# Altium project project_1.PrjPcb
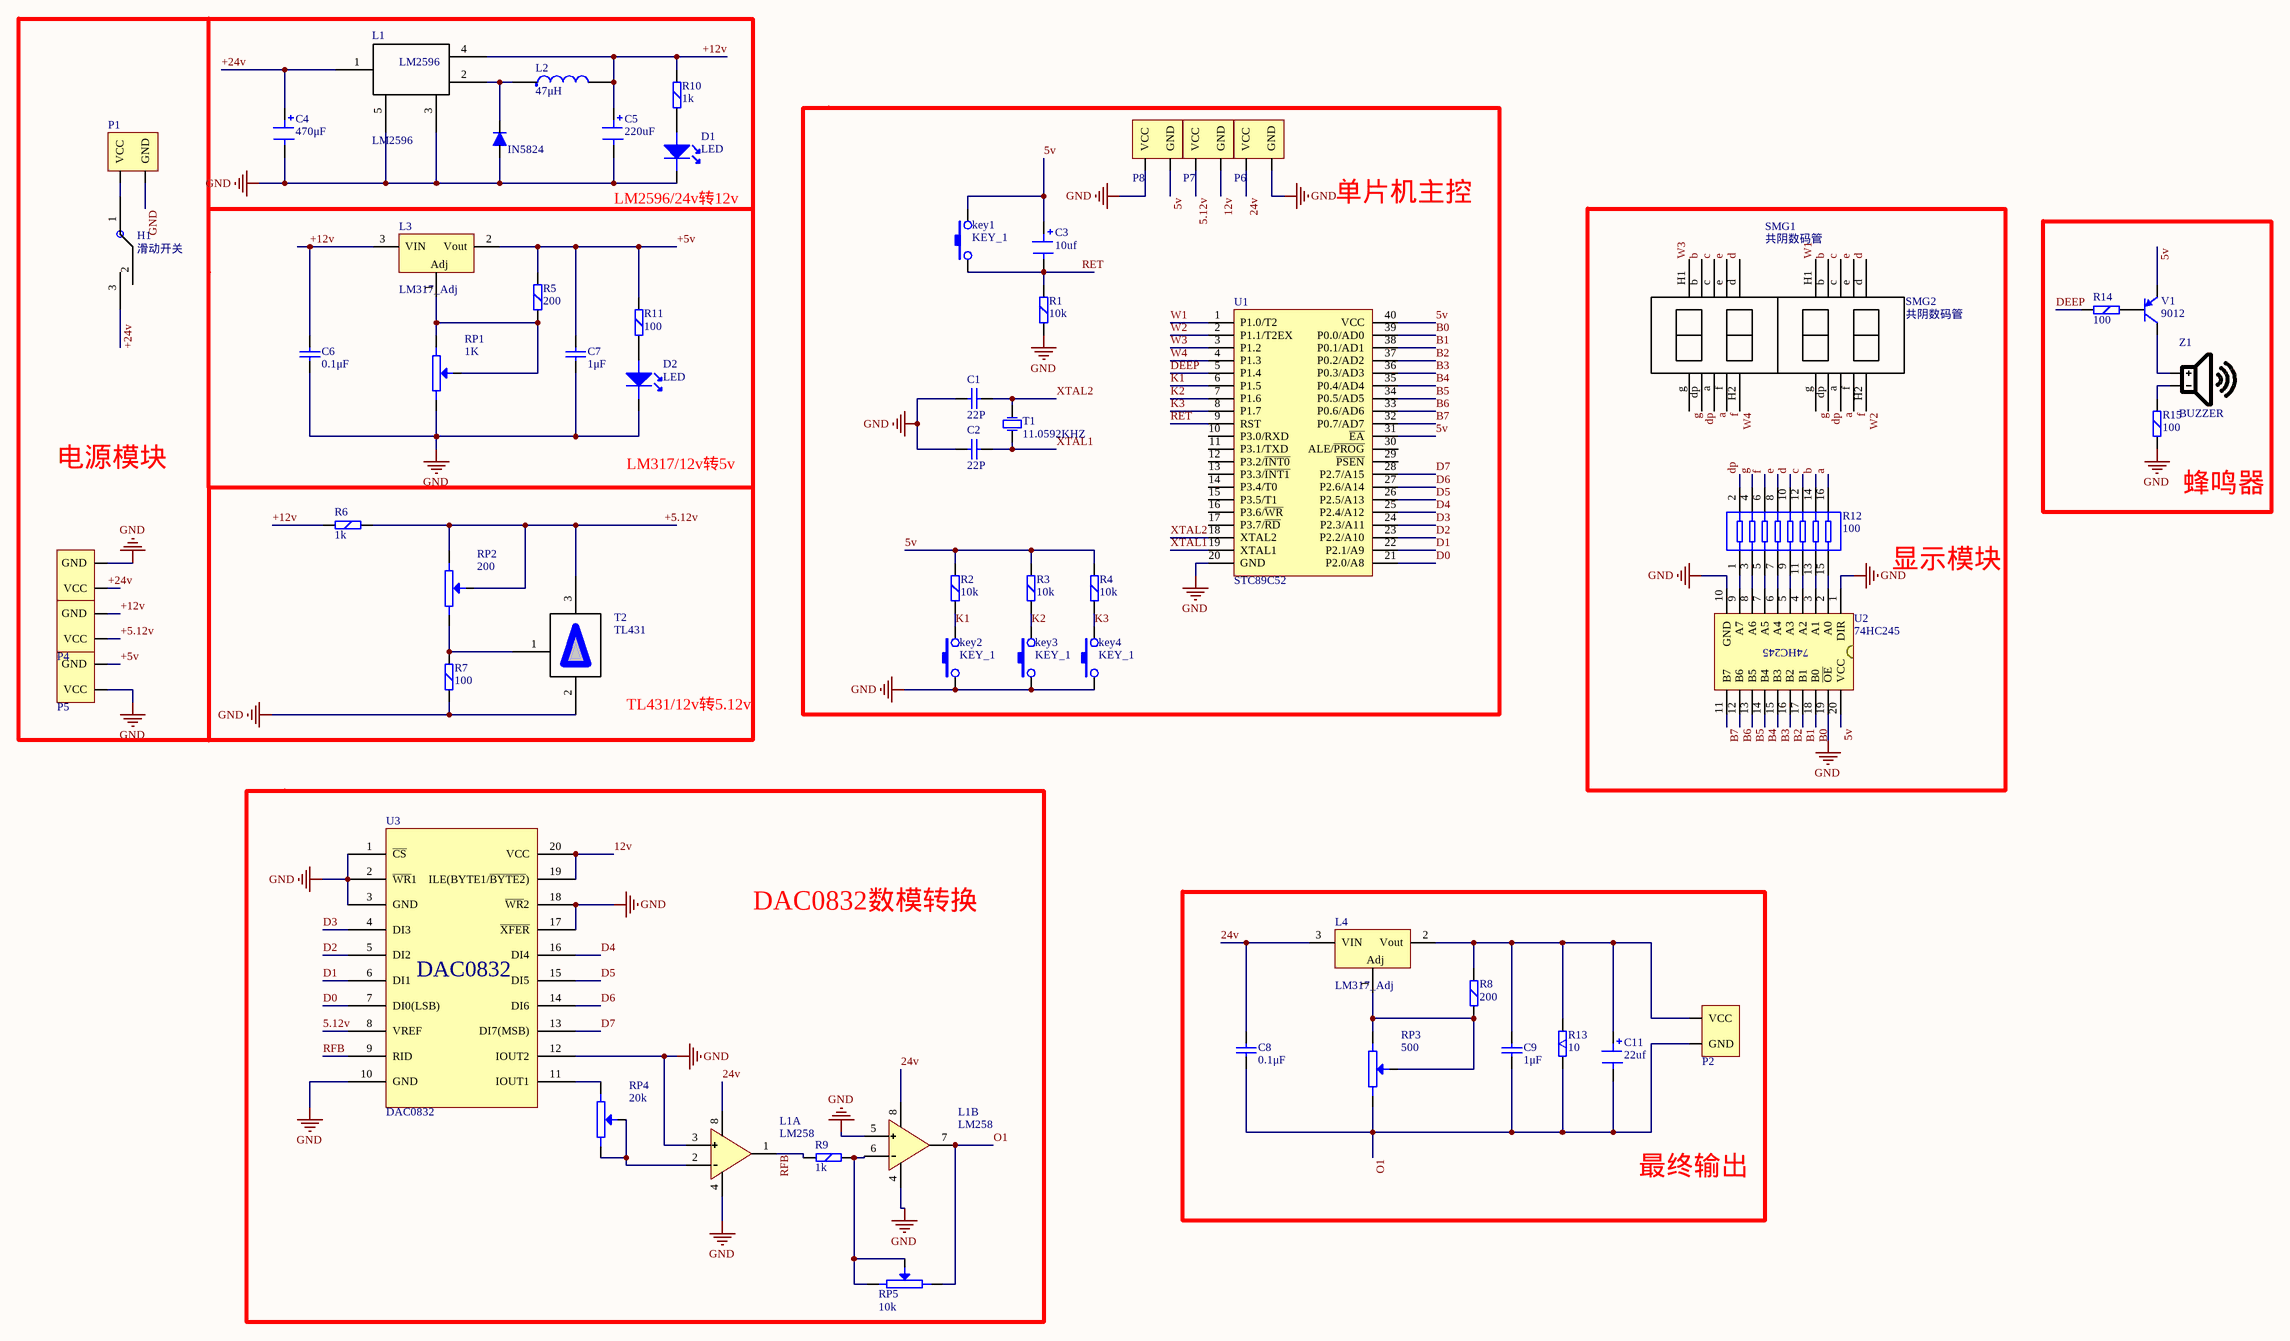
[diagram p0: Sheet1.SchDoc]
1 sheet, 60 parts. Net scope: global (net labels, ports and power ports of the same name join across sheets).

## Sheet Sheet1.SchDoc
size C

### Parts
(Parts that share a designator on the sheet are numbered #1, #2 ... from top to bottom, then left to right.)
C1  22P  [电容_瓷片]
C2  22P  [电容_瓷片]
C3  10uf  [电解电容_小]
C4  470μF  [电解电容_大]
C5  220uF  [电解电容_大]
C6  0.1μF  [电容_瓷片]
C7  1μF  [电容_瓷片]
C8  0.1μF  [电容_瓷片]
C9  1μF  [电容_瓷片]
C11  22uf  [电解电容_小]
D1  LED  [LED_G]
D2  LED  [LED_G]
D3  IN5824  [二极管_整流]
H1  滑动开关  [滑动开关]
key1  KEY_1  [AN66]
key2  KEY_1  [AN66]
key3  KEY_1  [AN66]
key4  KEY_1  [AN66]
L1#1  LM2596  [LM2596]
L1#2  LM258  [DIP8]  (parts A,B of 2)
L2  47μH  [AL0410_V]
L3  LM317_Adj  [7805散热器]
L4  LM317_Adj  [7805散热器]
P1  电源端子2P  [电源端子2P]  (value not drawn)
P2  电源端子2P  [电源端子2P]  (value not drawn)
P3  电源端子2P  [电源端子2P]  (value not drawn)
P4  电源端子2P  [电源端子2P]  (value not drawn)
P5  电源端子2P  [电源端子2P]  (value not drawn)
P6  电源端子2P  [电源端子2P]  (value not drawn)
P7  电源端子2P  [电源端子2P]  (value not drawn)
P8  电源端子2P  [电源端子2P]  (value not drawn)
R1  10k  [1/4WA1]
R2  10k  [1/4WA1]
R3  10k  [1/4WA1]
R4  10k  [1/4WA1]
R5  200  [1/4WA1]
R6  1k  [1/4WA1]
R7  100  [1/4WA1]
R8  200  [1/4WA1]
R9  1k  [1/4WA1]
R10  1k  [1/4WA1]
R11  100  [1/4WA1]
R12  100  [RES_PACK - 2]
R13  10  [AXIAL-20*5MM-W]
R14  100  [1/4WA1]
R15  100  [1/4WA1]
RP1  1K  [3296-103]
RP2  200  [3296-200]
RP3  500  [3296-103]
RP4  20k  [3296-203]
RP5  10k  [3296-100]
SMG1  共阴数码管  [0.36英寸2位数码管]
SMG2  共阴数码管  [0.36英寸2位数码管]
T1  11.0592KHZ  [晶振_小]
T2  TL431  [TL431]
U1  STC89C52  [DIP40]
U2  74HC245  [DIP20]
U3  DAC0832  [DIP20]
V1  9012  [三极管PNP]
Z1  BUZZER  [BUZZER]

### Blocks framed on the sheet
电源模块: C4-C7 D1-D3 H1 L1#1 L2 L3 P1 P3-P5 R5-R7 R10 R11 RP1 RP2 T2
单片机主控: C1-C3 key1-key4 P6-P8 R1-R4 T1 U1
显示模块: R12 SMG1 SMG2 U2
蜂鸣器: R14 R15 V1 Z1
DAC0832数模转换: L1#2 R9 RP4 RP5 U3
最终输出: C8 C9 C11 L4 P2 R8 R13 RP3

### Nets
GND: C1.1 C2.1 C4.2 C5.2 C6.1 C7.1 D1.2(K) D2.2(K) D3.1(A) key2.1 key3.1 key4.1 L1#1.3 L1#1.5 L1#2.3 L1#2.4 L1#2.5 P1.2(GND) P3.2(GND) P5.1(VCC) P6.2(GND) P8.1(VCC) R1.2 R7.2 R15.1 RP1.2 T2.2 U1.20(GND) U2.1(DIR) U2.10(GND) U2.19(~{OE}) U3.1(~{CS}) U3.2(~{WR}1) U3.3(GND) U3.10(GND) U3.12(IOUT2) U3.17(~{XFER}) U3.18(~{WR}2)
5.12v: P7.1(VCC) U3.8(VREF)
5v: C3.1 key1.2 P8.2(GND) R2.1 R3.1 R4.1 U1.31(~{EA}) U1.40(VCC) U2.20(VCC) V1.E
12v: P7.2(GND) U3.19(ILE(BYTE1/~{BYTE2})) U3.20(VCC)
24v: C8.2 L1#2.8 L4.3(VIN) P6.1(VCC)
+5.12v: P4.1(VCC) R6.2 RP2.1 RP2.3 T2.3
+5v: C7.2 L3.2(Vout) P5.2(GND) R5.1 R11.1
+12v: C5.1 C6.2 L1#1.4 L2.2 L3.3(VIN) P4.2(GND) R6.1 R10.1
+24v: C4.1 H1.3 L1#1.1 P3.1(VCC)
a: R12.16 SMG1.a SMG2.a
b: R12.14 SMG1.b SMG2.b
B0: U1.39(P0.0/AD0) U2.18(B0)
B1: U1.38(P0.1/AD1) U2.17(B1)
B2: U1.37(P0.2/AD2) U2.16(B2)
B3: U1.36(P0.3/AD3) U2.15(B3)
B4: U1.35(P0.4/AD4) U2.14(B4)
B5: U1.34(P0.5/AD5) U2.13(B5)
B6: U1.33(P0.6/AD6) U2.12(B6)
B7: U1.32(P0.7/AD7) U2.11(B7)
c: R12.12 SMG1.c SMG2.c
d: R12.10 SMG1.d SMG2.d
D0: U1.21(P2.0/A8) U3.7(DI0(LSB))
D1: U1.22(P2.1/A9) U3.6(DI1)
D2: U1.23(P2.2/A10) U3.5(DI2)
D3: U1.24(P2.3/A11) U3.4(DI3)
D4: U1.25(P2.4/A12) U3.16(DI4)
D5: U1.26(P2.5/A13) U3.15(DI5)
D6: U1.27(P2.6/A14) U3.14(DI6)
D7: U1.28(P2.7/A15) U3.13(DI7(MSB))
DEEP: R14.1 U1.5(P1.4)
dp: R12.2 SMG1.dp SMG2.dp
e: R12.8 SMG1.e SMG2.e
f: R12.6 SMG1.f SMG2.f
g: R12.4 SMG1.g SMG2.g
K1: key2.2 R2.2 U1.6(P1.5)
K2: key3.2 R3.2 U1.7(P1.6)
K3: key4.2 R4.2 U1.8(P1.7)
O1: C8.1 C9.1 C11.2 L1#2.7 P2.2(GND) R13.2 RP3.2 RP5.2
RET: C3.2 key1.1 R1.1 U1.9(RST)
RFB: L1#2.1 R9.1 U3.9(RID)
W1: SMG2.H1 U1.1(P1.0/T2)
W2: SMG2.H2 U1.2(P1.1/T2EX)
W3: SMG1.H1 U1.3(P1.2)
W4: SMG1.H2 U1.4(P1.3)
XTAL1: C2.2 T1.2(OSC2) U1.19(XTAL1)
XTAL2: C1.2 T1.1(OSC1) U1.18(XTAL2)
NetC9_2: C9.2 C11.1 L4.2(Vout) P2.1(VCC) R8.1 R13.1
NetD1_1: D1.1(A) R10.2
NetD2_1: D2.1(A) R11.2
NetD3_2: D3.2(K) L1#1.2 L2.1
NetH1_1: H1.1 P1.1(VCC)
NetL1#2_2: L1#2.2 RP4.2 RP4.3
NetL1#2_6: L1#2.6 R9.2 RP5.1 RP5.3
NetL3_1: L3.1(Adj) R5.2 RP1.1 RP1.3
NetL4_1: L4.1(Adj) R8.2 RP3.1 RP3.3
NetR7_1: R7.1 RP2.2 T2.1
NetR12_1: R12.1 U2.9(A7)
NetR12_3: R12.3 U2.8(A6)
NetR12_5: R12.5 U2.7(A5)
NetR12_7: R12.7 U2.6(A4)
NetR12_9: R12.9 U2.5(A3)
NetR12_11: R12.11 U2.4(A2)
NetR12_13: R12.13 U2.3(A1)
NetR12_15: R12.15 U2.2(A0)
NetR14_2: R14.2 V1.B
NetR15_2: R15.2 Z1.2
NetRP4_1: RP4.1 U3.11(IOUT1)
NetV1_C: V1.C Z1.1

Not connected (* = marked no-connect by the designer): H1 2; U1 10(P3.0/RXD) 11(P3.1/TXD) 12(P3.2/~{INT0}) 13(P3.3/~{INT1}) 14(P3.4/T0) 15(P3.5/T1) 16(P3.6/~{WR}) 17(P3.7/~{RD}) 29(~{PSEN}) 30(ALE/~{PROG})

### Notes on the sheet
- (near D1) LM2596/24v转12v
- LM317/12v转5v
- TL431/12v转5.12v

### Library data of the parts
C1 C2 C6-C9 = 电容_瓷片: 瓷片电容
C3 C11 = 电解电容_小: 电解电容
C4 C5 = 电解电容_大: 电解电容
D1 D2 = LED: 发光二极管; Component Link1Description: 元件数据连接1，一般是生产厂商的元件描述连接。; Component Link 1URL: 元件厂商的网站连接1，通常是主页地址，如http://www.st.com/; ComponentLink2  Description: 元件数据连接2，一般是生产厂商的元件数据库连接。; Component Link 2URL: 元件厂商的网站连接2，通常是元件数据说明文件地址，如http://www.fairchildsemi.com/ds/2N%2F2N3904.pdf; Kind: General; Latest Revision Note: 最近的应用笔记修订本; Object: Diode; Created: 制造厂商; Datasheet Version: Apr-2016; Latest Revision Date: 13-Apr-2016; Package Description: DIODE0.4及DIODE0.7; Published: 13-Apr-2016; Publisher: Altium Limited; Spice Prefix: D; SubKind: Diode; Type: Diode
D3 = 二极管_整流: 整流二极管
L2 = Inductor4: Component Link1Description: 元件数据连接1，一般是生产厂商的元件描述连接。; Component Link 1URL: 元件厂商的网站连接1，通常是主页地址，如http://www.st.com/; ComponentLink2  Description: 元件数据连接2，一般是生产厂商的元件数据库连接。; Component Link 2URL: 元件厂商的网站连接2，通常是元件数据说明文件地址，如http://www.fairchildsemi.com/ds/2N%2F2N3904.pdf; Kind: General; Latest Revision Note: 最近的应用笔记修订本; Published: 13-Apr-2016; LatestRevisionDate: 13-Apr-2016; LatestRevisionNote: Re-released for DXP Platform.; PackageReference: 425; Publisher: Altium Limited; Created: 制造厂商; Datasheet Version: Apr-2016; Latest Revision Date: 13-Apr-2016; Object: Inductor; Package Description: 封装描述; Spice Prefix: L; SubKind: Inductor
L3 L4 = LM317: 可调直流稳压芯片
P1-P8 = 电源端子2P: 电源端子
R1-R4 = Res_3: 1/4W电阻器; Object: Resistor; Kind: General; Latest Revision Note: 最近的应用笔记修订本; Component Link1Description: 元件数据连接1，一般是生产厂商的元件描述连接。; ComponentLink2  Description: 元件数据连接2，一般是生产厂商的元件数据库连接。; Component Link 1URL: 元件厂商的网站连接1，通常是主页地址，如http://www.st.com/; Component Link 2URL: 元件厂商的网站连接2，通常是元件数据说明文件地址，如http://www.fairchildsemi.com/ds/2N%2F2N3904.pdf; LatestRevisionDate: 13-Apr-2016; Published: 13-Apr-2016; Publisher: Altium Limited; Created: 制造厂商; Datasheet Version: Apr-2016; Package Reference: AXIAL; Spice Prefix: R; Latest Revision Date: 13-Apr-2016; Package Description: AXIAL0.3-AXIA1.0; PackageVersion: Apr-2016; SubKind: Resistor; Type: Resistor; Value: 10K
R5-R11 R14 R15 = Res_3: 1/4W电阻器; Object: Resistor; Kind: General; Latest Revision Note: 最近的应用笔记修订本; Component Link1Description: 元件数据连接1，一般是生产厂商的元件描述连接。; ComponentLink2  Description: 元件数据连接2，一般是生产厂商的元件数据库连接。; Component Link 1URL: 元件厂商的网站连接1，通常是主页地址，如http://www.st.com/; Component Link 2URL: 元件厂商的网站连接2，通常是元件数据说明文件地址，如http://www.fairchildsemi.com/ds/2N%2F2N3904.pdf; Value: 10K; LatestRevisionDate: 13-Apr-2016; Published: 13-Apr-2016; Publisher: Altium Limited; Created: 制造厂商; Datasheet Version: Apr-2016; Package Reference: AXIAL; Spice Prefix: R; Latest Revision Date: 13-Apr-2016; Package Description: AXIAL0.3-AXIA1.0; PackageVersion: Apr-2016; SubKind: Resistor; Type: Resistor
R12 = Res_Pack8: 排阻; Object: Resistor; Kind: General; Latest Revision Note: 最近的应用笔记修订本; Component Link1Description: 元件数据连接1，一般是生产厂商的元件描述连接。; ComponentLink2  Description: 元件数据连接2，一般是生产厂商的元件数据库连接。; Component Link 1URL: 元件厂商的网站连接1，通常是主页地址，如http://www.st.com/; Component Link 2URL: 元件厂商的网站连接2，通常是元件数据说明文件地址，如http://www.fairchildsemi.com/ds/2N%2F2N3904.pdf; Value: 10K; LatestRevisionDate: 13-Apr-2016; Published: 13-Apr-2016; Publisher: Altium Limited; Created: 制造厂商; Datasheet Version: Apr-2016; Package Reference: AXIAL; Spice Prefix: R; Latest Revision Date: 13-Apr-2016; Package Description: AXIAL0.3-AXIA1.0; PackageVersion: Apr-2016; SubKind: Resistor; Type: Resistor
R13 = Res_7: 5W电阻器; Object: Resistor; Kind: General; Latest Revision Note: 最近的应用笔记修订本; Component Link1Description: 元件数据连接1，一般是生产厂商的元件描述连接。; ComponentLink2  Description: 元件数据连接2，一般是生产厂商的元件数据库连接。; Component Link 1URL: 元件厂商的网站连接1，通常是主页地址，如http://www.st.com/; Component Link 2URL: 元件厂商的网站连接2，通常是元件数据说明文件地址，如http://www.fairchildsemi.com/ds/2N%2F2N3904.pdf; Value: 10K; LatestRevisionDate: 13-Apr-2016; Published: 13-Apr-2016; Publisher: Altium Limited; Created: 制造厂商; Datasheet Version: Apr-2016; Package Reference: AXIAL; Spice Prefix: R; Latest Revision Date: 13-Apr-2016; Package Description: AXIAL0.3-AXIA1.0; PackageVersion: Apr-2016; SubKind: Resistor; Type: Resistor
RP1-RP4 = RESVR: 滑动触点电位器; Object: Resistor; Kind: General; Latest Revision Note: 最近的应用笔记修订本; Component Link1Description: 元件数据连接1，一般是生产厂商的元件描述连接。; ComponentLink2  Description: 元件数据连接2，一般是生产厂商的元件数据库连接。; Component Link 1URL: 元件厂商的网站连接1，通常是主页地址，如http://www.st.com/; Component Link 2URL: 元件厂商的网站连接2，通常是元件数据说明文件地址，如http://www.fairchildsemi.com/ds/2N%2F2N3904.pdf; Value: 10K; LatestRevisionDate: 13-Apr-2016; Published: 13-Apr-2016; Publisher: Altium Limited; Created: 制造厂商; Datasheet Version: Apr-2016; Package Reference: AXIAL; Spice Prefix: R; Latest Revision Date: 13-Apr-2016; Package Description: AXIAL0.3-AXIA1.0; PackageVersion: Apr-2016; SubKind: Resistor; Type: Resistor
RP5 = RESVR: 滑动触点电位器; Object: Resistor; Kind: General; Latest Revision Note: 最近的应用笔记修订本; Component Link1Description: 元件数据连接1，一般是生产厂商的元件描述连接。; ComponentLink2  Description: 元件数据连接2，一般是生产厂商的元件数据库连接。; Component Link 1URL: 元件厂商的网站连接1，通常是主页地址，如http://www.st.com/; Component Link 2URL: 元件厂商的网站连接2，通常是元件数据说明文件地址，如http://www.fairchildsemi.com/ds/2N%2F2N3904.pdf; LatestRevisionDate: 13-Apr-2016; Published: 13-Apr-2016; Publisher: Altium Limited; Created: 制造厂商; Datasheet Version: Apr-2016; Package Reference: AXIAL; Spice Prefix: R; Latest Revision Date: 13-Apr-2016; Package Description: AXIAL0.3-AXIA1.0; PackageVersion: Apr-2016; SubKind: Resistor; Type: Resistor; Value: 10K
SMG1 SMG2 = 二位数码管
T1 = 晶振_小: 晶振
U1 = STC89C52: 51系列单片机; Component Link1Description: 元件数据连接1，一般是生产厂商的元件描述连接。; Component Link 1URL: 元件厂商的网站连接1，通常是主页地址，如http://www.st.com/; ComponentLink2  Description: 元件数据连接2，一般是生产厂商的元件数据库连接。; Component Link 2URL: 元件厂商的网站连接2，通常是元件数据说明文件地址，如http://www.fairchildsemi.com/ds/2N%2F2N3904.pdf; Kind: General; Latest Revision Note: 最近的应用笔记修订本; SubKind: Chip; Created: 制造厂商; Datasheet Version: Jun-2016; Latest Revision Date: 5-Jun-2016; Package Description: DIP-40; Published: 5-Jun-2016; Publisher: Altium Limited; Spice Prefix: U
U2 = 74HC245: 总线驱动器
U3 = DAC0832: 数模转换器件; Component Link1Description: 元件数据连接1，一般是生产厂商的元件描述连接。; Component Link 1URL: 元件厂商的网站连接1，通常是主页地址，如http://www.st.com/; ComponentLink2  Description: 元件数据连接2，一般是生产厂商的元件数据库连接。; Component Link 2URL: 元件厂商的网站连接2，通常是元件数据说明文件地址，如http://www.fairchildsemi.com/ds/2N%2F2N3904.pdf; Kind: General; Latest Revision Note: 最近的应用笔记修订本; SubKind: Chip; 价格: 0.0; Created: 制造厂商; Datasheet Version: Apr-2016; Latest Revision Date: 14-Apr-2016; Package Description: 封装描述; Published: 14-Apr-2016; Publisher: Altium Limited; Spice Prefix: U; LatestRevisionDate: 5-Sep-2016
V1 = 9012三极管: PNP三极管
Z1 = BUZZER: 蜂鸣器